# Altium schematic sheet PowerSupply.SchDoc
size A4
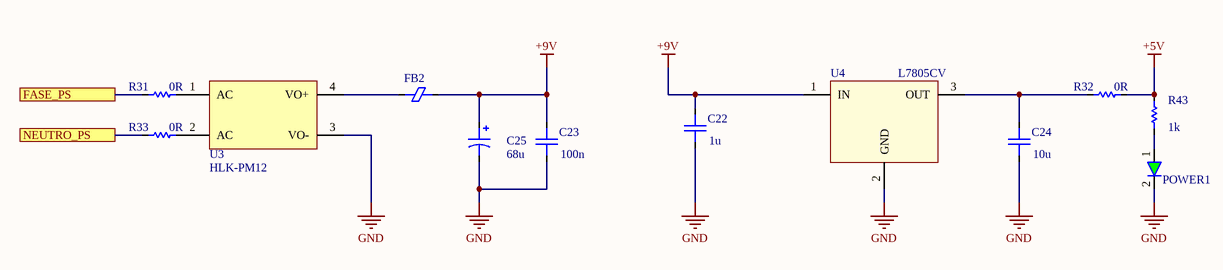
[diagram p0: PowerSupply.SchDoc]

## Parts
C22  value 1u  [CAP0603]  (hidden comment: Capacitor)
C23  value 100n  [CAP0603]  (hidden comment: Capacitor)
C24  value 10u  [CAP0603]  (hidden comment: Capacitor)
C25  value 68u  [CAP_ALU_6.3x7.7]  (hidden comment: Capacitor)
FB2  Ferrite Bead  [FB0603]  (value not drawn)
POWER1  LED Green  [HDR1X2]  (value not drawn)
R31  value 0R  [RES0603]  (hidden comment: Resistor)
R32  value 0R  [RES0603]  (hidden comment: Resistor)
R33  value 0R  [RES0603]  (hidden comment: Resistor)
R43  value 1k  [RES0603]  (hidden comment: Resistor)
U3  HLK-PM12  [HLP-PM12]
U4  L7805CV  [TO-220 - 90°]

## Ports
FASE_PS, NEUTRO_PS

## Nets
+5V: R32.1 R43.1
+9V: C22.2 C23.2 C25.1 FB2.1 U4.1(IN)
GND: C22.1 C23.1 C24.1 C25.2 POWER1.2(K) U3.3(VO-) U4.2(GND)
FASE_PS: R31.2 ; port FASE_PS
NEUTRO_PS: R33.2 ; port NEUTRO_PS
NetC24_2: C24.2 R32.2 U4.3(OUT)
NetFB2_2: FB2.2 U3.4(VO+)
NetPOWER1_1: POWER1.1(A) R43.2
NetR31_1: R31.1 U3.1(AC)
NetR33_1: R33.1 U3.2(AC)

## Library data of the parts
C22-C24 = Capacitor: CAP CER SMD 0603; Manufacturer: -; Part Number: -; PCB Info: -
C25 = Capacitor Polarizado
U3 = HLK-PM12: Flyback power supply AC to 12V@3W; Manufacturer: HI-LINK; Value: 90-264 VAC to 12VDC@3W; Part Number: HLK-PM12; PCB Info: -
U4 = L7805CV: IC REG LINEAR 5V 1.5A TO220; Manufacturer: STMicroelectronics; Value: -; Part Number: L7805CV
POWER1 = LED Green: Manufacturer: -; PCB Info: -; Value: -; Part Number: -